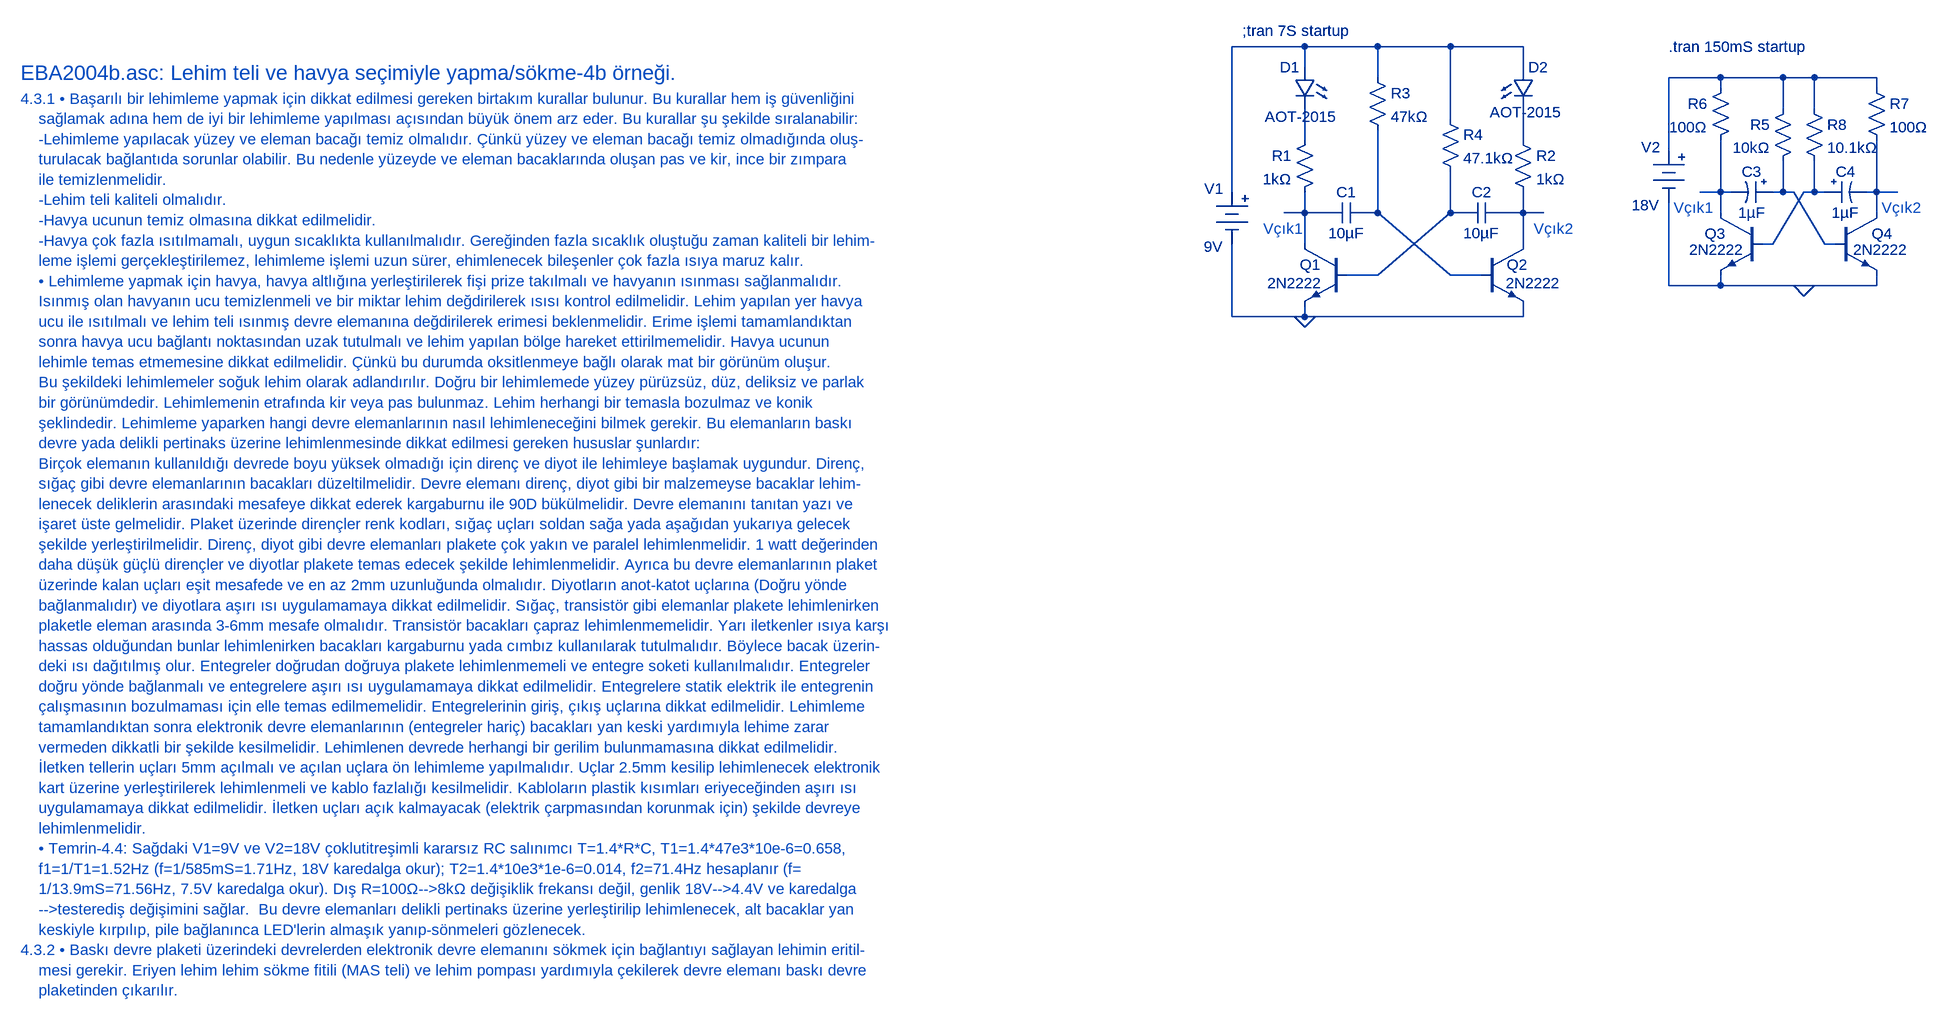
[diagram p0: schematic EBA2004b.asc]
EBA2004b.asc, the LTspice schematic file:
Version 4
SHEET 1 7064 4332
WIRE 1744 16 1632 16
WIRE 1856 16 1744 16
WIRE 1968 16 1856 16
WIRE 2080 16 1968 16
WIRE 1744 48 1744 16
WIRE 2080 48 2080 16
WIRE 1856 64 1856 16
WIRE 2384 64 2304 64
WIRE 2480 64 2384 64
WIRE 2528 64 2480 64
WIRE 2624 64 2528 64
WIRE 2384 80 2384 64
WIRE 2624 80 2624 64
WIRE 2480 112 2480 64
WIRE 2528 112 2528 64
WIRE 1968 128 1968 16
WIRE 1744 160 1744 112
WIRE 2080 160 2080 112
WIRE 2304 176 2304 64
WIRE 1632 240 1632 16
WIRE 2384 240 2384 160
WIRE 2384 240 2352 240
WIRE 2400 240 2384 240
WIRE 2480 240 2480 192
WIRE 2480 240 2464 240
WIRE 2496 240 2480 240
WIRE 2528 240 2528 192
WIRE 2528 240 2512 240
WIRE 2544 240 2528 240
WIRE 2624 240 2624 160
WIRE 2624 240 2608 240
WIRE 2656 240 2624 240
WIRE 1744 272 1744 240
WIRE 1744 272 1712 272
WIRE 1776 272 1744 272
WIRE 1856 272 1856 144
WIRE 1856 272 1840 272
WIRE 1968 272 1968 208
WIRE 1984 272 1968 272
WIRE 2080 272 2080 240
WIRE 2080 272 2048 272
WIRE 2112 272 2080 272
WIRE 2384 272 2384 240
WIRE 2624 272 2624 240
WIRE 1744 320 1744 272
WIRE 2080 320 2080 272
WIRE 2464 320 2512 240
WIRE 2464 320 2448 320
WIRE 2544 320 2496 240
WIRE 2560 320 2544 320
WIRE 1856 368 1968 272
WIRE 1856 368 1808 368
WIRE 1968 368 1856 272
WIRE 2016 368 1968 368
WIRE 2304 384 2304 256
WIRE 2384 384 2384 368
WIRE 2384 384 2304 384
WIRE 2512 384 2384 384
WIRE 2624 384 2624 368
WIRE 2624 384 2512 384
WIRE 1632 432 1632 320
WIRE 1744 432 1744 416
WIRE 1744 432 1632 432
WIRE 2080 432 2080 416
WIRE 2080 432 1744 432
FLAG 1744 432 0
FLAG 2512 384 0
SYMBOL Misc\\battery 1632 224 M0
WINDOW 0 13 11 Left 2
WINDOW 3 14 100 Left 2
SYMATTR InstName V1
SYMATTR Value 9V
SYMBOL npn 1808 320 M0
WINDOW 0 39 32 Left 2
WINDOW 3 37 60 Left 2
SYMATTR InstName Q1
SYMATTR Value 2N2222
SYMBOL npn 2016 320 R0
WINDOW 0 39 32 Left 2
WINDOW 3 37 60 Left 2
SYMATTR InstName Q2
SYMATTR Value 2N2222
SYMBOL res 1760 144 M0
SYMATTR InstName R1
SYMATTR Value 1kΩ
SYMBOL res 2064 144 R0
SYMATTR InstName R2
SYMATTR Value 1kΩ
SYMBOL LED 1760 48 M0
WINDOW 3 -34 76 Left 2
SYMATTR Value AOT-2015
SYMATTR InstName D1
SYMATTR Description Diode
SYMATTR Type diode
SYMBOL LED 2064 48 R0
WINDOW 3 -35 69 Left 2
SYMATTR Value AOT-2015
SYMATTR InstName D2
SYMATTR Description Diode
SYMATTR Type diode
SYMBOL res 1840 48 R0
SYMATTR InstName R3
SYMATTR Value 47kΩ
SYMBOL res 1952 112 R0
SYMATTR InstName R4
SYMATTR Value 47.1kΩ
SYMBOL cap 1840 256 R90
WINDOW 0 0 32 VBottom 2
WINDOW 3 32 32 VTop 2
SYMATTR InstName C1
SYMATTR Value 10µF
SYMBOL cap 2048 256 R90
WINDOW 0 0 32 VBottom 2
WINDOW 3 32 32 VTop 2
SYMATTR InstName C2
SYMATTR Value 10µF
SYMBOL npn 2448 272 M0
WINDOW 3 28 57 Left 2
SYMATTR Value 2N2222
SYMATTR InstName Q3
SYMBOL res 2496 96 M0
SYMATTR InstName R5
SYMATTR Value 10kΩ
SYMBOL polcap 2464 224 R90
WINDOW 0 0 32 VBottom 2
WINDOW 3 32 32 VTop 2
SYMATTR InstName C3
SYMATTR Value 1µF
SYMBOL res 2400 64 M0
SYMATTR InstName R6
SYMATTR Value 100Ω
SYMBOL npn 2560 272 R0
WINDOW 3 28 57 Left 2
SYMATTR Value 2N2222
SYMATTR InstName Q4
SYMBOL res 2608 64 R0
SYMATTR InstName R7
SYMATTR Value 100Ω
SYMBOL polcap 2544 224 M90
WINDOW 0 0 32 VBottom 2
WINDOW 3 32 32 VTop 2
SYMATTR InstName C4
SYMATTR Value 1µF
SYMBOL res 2512 96 R0
SYMATTR InstName R8
SYMATTR Value 10.1kΩ
SYMBOL Misc\\battery 2304 160 M0
WINDOW 0 13 11 Left 2
WINDOW 3 14 100 Left 2
SYMATTR InstName V2
SYMATTR Value 18V
TEXT -232 56 Left 3 ;EBA2004b.asc: Lehim teli ve havya seçimiyle yapma/sökme-4b örneği.
TEXT -232 96 Left 2 ;4.3.1 • Başarılı bir lehimleme yapmak için dikkat edilmesi gereken birtakım kurallar bulunur. Bu kurallar hem iş güvenliğini \n    sağlamak adına hem de iyi bir lehimleme yapılması açısından büyük önem arz eder. Bu kurallar şu şekilde sıralanabilir:\n    -Lehimleme yapılacak yüzey ve eleman bacağı temiz olmalıdır. Çünkü yüzey ve eleman bacağı temiz olmadığında oluş-\n    turulacak bağlantıda sorunlar olabilir. Bu nedenle yüzeyde ve eleman bacaklarında oluşan pas ve kir, ince bir zımpara \n    ile temizlenmelidir.\n    -Lehim teli kaliteli olmalıdır.\n    -Havya ucunun temiz olmasına dikkat edilmelidir.\n    -Havya çok fazla ısıtılmamalı, uygun sıcaklıkta kullanılmalıdır. Gereğinden fazla sıcaklık oluştuğu zaman kaliteli bir lehim-\n    leme işlemi gerçekleştirilemez, lehimleme işlemi uzun sürer, ehimlenecek bileşenler çok fazla ısıya maruz kalır.\n    • Lehimleme yapmak için havya, havya altlığına yerleştirilerek fişi prize takılmalı ve havyanın ısınması sağlanmalıdır.\n    Isınmış olan havyanın ucu temizlenmeli ve bir miktar lehim değdirilerek ısısı kontrol edilmelidir. Lehim yapılan yer havya \n    ucu ile ısıtılmalı ve lehim teli ısınmış devre elemanına değdirilerek erimesi beklenmelidir. Erime işlemi tamamlandıktan \n    sonra havya ucu bağlantı noktasından uzak tutulmalı ve lehim yapılan bölge hareket ettirilmemelidir. Havya ucunun \n    lehimle temas etmemesine dikkat edilmelidir. Çünkü bu durumda oksitlenmeye bağlı olarak mat bir görünüm oluşur. \n    Bu şekildeki lehimlemeler soğuk lehim olarak adlandırılır. Doğru bir lehimlemede yüzey pürüzsüz, düz, deliksiz ve parlak \n    bir görünümdedir. Lehimlemenin etrafında kir veya pas bulunmaz. Lehim herhangi bir temasla bozulmaz ve konik\n    şeklindedir. Lehimleme yaparken hangi devre elemanlarının nasıl lehimleneceğini bilmek gerekir. Bu elemanların baskı \n    devre yada delikli pertinaks üzerine lehimlenmesinde dikkat edilmesi gereken hususlar şunlardır:\n    Birçok elemanın kullanıldığı devrede boyu yüksek olmadığı için direnç ve diyot ile lehimleye başlamak uygundur. Direnç, \n    sığaç gibi devre elemanlarının bacakları düzeltilmelidir. Devre elemanı direnç, diyot gibi bir malzemeyse bacaklar lehim-\n    lenecek deliklerin arasındaki mesafeye dikkat ederek kargaburnu ile 90D bükülmelidir. Devre elemanını tanıtan yazı ve \n    işaret üste gelmelidir. Plaket üzerinde dirençler renk kodları, sığaç uçları soldan sağa yada aşağıdan yukarıya gelecek \n    şekilde yerleştirilmelidir. Direnç, diyot gibi devre elemanları plakete çok yakın ve paralel lehimlenmelidir. 1 watt değerinden\n    daha düşük güçlü dirençler ve diyotlar plakete temas edecek şekilde lehimlenmelidir. Ayrıca bu devre elemanlarının plaket \n    üzerinde kalan uçları eşit mesafede ve en az 2mm uzunluğunda olmalıdır. Diyotların anot-katot uçlarına (Doğru yönde \n    bağlanmalıdır) ve diyotlara aşırı ısı uygulamamaya dikkat edilmelidir. Sığaç, transistör gibi elemanlar plakete lehimlenirken \n    plaketle eleman arasında 3-6mm mesafe olmalıdır. Transistör bacakları çapraz lehimlenmemelidir. Yarı iletkenler ısıya karşı \n    hassas olduğundan bunlar lehimlenirken bacakları kargaburnu yada cımbız kullanılarak tutulmalıdır. Böylece bacak üzerin-\n    deki ısı dağıtılmış olur. Entegreler doğrudan doğruya plakete lehimlenmemeli ve entegre soketi kullanılmalıdır. Entegreler\n    doğru yönde bağlanmalı ve entegrelere aşırı ısı uygulamamaya dikkat edilmelidir. Entegrelere statik elektrik ile entegrenin \n    çalışmasının bozulmaması için elle temas edilmemelidir. Entegrelerinin giriş, çıkış uçlarına dikkat edilmelidir. Lehimleme \n    tamamlandıktan sonra elektronik devre elemanlarının (entegreler hariç) bacakları yan keski yardımıyla lehime zarar \n    vermeden dikkatli bir şekilde kesilmelidir. Lehimlenen devrede herhangi bir gerilim bulunmamasına dikkat edilmelidir.\n    İletken tellerin uçları 5mm açılmalı ve açılan uçlara ön lehimleme yapılmalıdır. Uçlar 2.5mm kesilip lehimlenecek elektronik \n    kart üzerine yerleştirilerek lehimlenmeli ve kablo fazlalığı kesilmelidir. Kabloların plastik kısımları eriyeceğinden aşırı ısı \n    uygulamamaya dikkat edilmelidir. İletken uçları açık kalmayacak (elektrik çarpmasından korunmak için) şekilde devreye\n    lehimlenmelidir.\n    • Temrin-4.4: Sağdaki V1=9V ve V2=18V çoklutitreşimli kararsız RC salınımcı T=1.4*R*C, T1=1.4*47e3*10e-6=0.658,\n    f1=1/T1=1.52Hz (f=1/585mS=1.71Hz, 18V karedalga okur); T2=1.4*10e3*1e-6=0.014, f2=71.4Hz hesaplanır (f=\n    1/13.9mS=71.56Hz, 7.5V karedalga okur). Dış R=100Ω-->8kΩ değişiklik frekansı değil, genlik 18V-->4.4V ve karedalga\n    -->testerediş değişimini sağlar.  Bu devre elemanları delikli pertinaks üzerine yerleştirilip lehimlenecek, alt bacaklar yan\n    keskiyle kırpılıp, pile bağlanınca LED'lerin almaşık yanıp-sönmeleri gözlenecek.\n4.3.2 • Baskı devre plaketi üzerindeki devrelerden elektronik devre elemanını sökmek için bağlantıyı sağlayan lehimin eritil-\n    mesi gerekir. Eriyen lehim lehim sökme fitili (MAS teli) ve lehim pompası yardımıyla çekilerek devre elemanı baskı devre \n    plaketinden çıkarılır.
TEXT 1648 -8 Left 2 !;tran 7S startup
TEXT 2312 264 Left 2 ;Vçık1
TEXT 2632 264 Left 2 ;Vçık2
TEXT 2096 296 Left 2 ;Vçık2
TEXT 1680 296 Left 2 ;Vçık1
TEXT 2304 16 Left 2 !.tran 150mS startup

The netlist it stands for:
* EBA2004b.asc
V1 N001 0 9V
Q1 N009 N011 0 0 2N2222
Q2 N012 N010 0 0 2N2222
R1 N003 N009 1kΩ
R2 N004 N012 1kΩ
D1 N001 N003 AOT-2015
D2 N001 N004 AOT-2015
R3 N001 N010 47kΩ
R4 N001 N011 47.1kΩ
C1 N010 N009 10µF
C2 N012 N011 10µF
Q3 N005 N007 0 0 2N2222
R5 N002 N006 10kΩ
C3 N006 N005 1µF
R6 N002 N005 100Ω
Q4 N008 N006 0 0 2N2222
R7 N002 N008 100Ω
C4 N007 N008 1µF
R8 N002 N007 10.1kΩ
V2 N002 0 18V
.model D D
.lib standard.dio
.model NPN NPN
.model PNP PNP
.lib standard.bjt
* EBA2004b.asc: Lehim teli ve havya seçimiyle yapma/sökme-4b örneği.
* 4.3.1 • Başarılı bir lehimleme yapmak için dikkat edilmesi gereken birtakım kurallar bulunur. Bu kurallar hem iş güvenliğini
*     sağlamak adına hem de iyi bir lehimleme yapılması açısından büyük önem arz eder. Bu kurallar şu şekilde sıralanabilir:
*     -Lehimleme yapılacak yüzey ve eleman bacağı temiz olmalıdır. Çünkü yüzey ve eleman bacağı temiz olmadığında oluş-
*     turulacak bağlantıda sorunlar olabilir. Bu nedenle yüzeyde ve eleman bacaklarında oluşan pas ve kir, ince bir zımpara
*     ile temizlenmelidir.
*     -Lehim teli kaliteli olmalıdır.
*     -Havya ucunun temiz olmasına dikkat edilmelidir.
*     -Havya çok fazla ısıtılmamalı, uygun sıcaklıkta kullanılmalıdır. Gereğinden fazla sıcaklık oluştuğu zaman kaliteli bir lehim-
*     leme işlemi gerçekleştirilemez, lehimleme işlemi uzun sürer, ehimlenecek bileşenler çok fazla ısıya maruz kalır.
*     • Lehimleme yapmak için havya, havya altlığına yerleştirilerek fişi prize takılmalı ve havyanın ısınması sağlanmalıdır.
*     Isınmış olan havyanın ucu temizlenmeli ve bir miktar lehim değdirilerek ısısı kontrol edilmelidir. Lehim yapılan yer havya
*     ucu ile ısıtılmalı ve lehim teli ısınmış devre elemanına değdirilerek erimesi beklenmelidir. Erime işlemi tamamlandıktan
*     sonra havya ucu bağlantı noktasından uzak tutulmalı ve lehim yapılan bölge hareket ettirilmemelidir. Havya ucunun
*     lehimle temas etmemesine dikkat edilmelidir. Çünkü bu durumda oksitlenmeye bağlı olarak mat bir görünüm oluşur.
*     Bu şekildeki lehimlemeler soğuk lehim olarak adlandırılır. Doğru bir lehimlemede yüzey pürüzsüz, düz, deliksiz ve parlak
*     bir görünümdedir. Lehimlemenin etrafında kir veya pas bulunmaz. Lehim herhangi bir temasla bozulmaz ve konik
*     şeklindedir. Lehimleme yaparken hangi devre elemanlarının nasıl lehimleneceğini bilmek gerekir. Bu elemanların baskı
*     devre yada delikli pertinaks üzerine lehimlenmesinde dikkat edilmesi gereken hususlar şunlardır:
*     Birçok elemanın kullanıldığı devrede boyu yüksek olmadığı için direnç ve diyot ile lehimleye başlamak uygundur. Direnç,
*     sığaç gibi devre elemanlarının bacakları düzeltilmelidir. Devre elemanı direnç, diyot gibi bir malzemeyse bacaklar lehim-
*     lenecek deliklerin arasındaki mesafeye dikkat ederek kargaburnu ile 90D bükülmelidir. Devre elemanını tanıtan yazı ve
*     işaret üste gelmelidir. Plaket üzerinde dirençler renk kodları, sığaç uçları soldan sağa yada aşağıdan yukarıya gelecek
*     şekilde yerleştirilmelidir. Direnç, diyot gibi devre elemanları plakete çok yakın ve paralel lehimlenmelidir. 1 watt değerinden
*     daha düşük güçlü dirençler ve diyotlar plakete temas edecek şekilde lehimlenmelidir. Ayrıca bu devre elemanlarının plaket
*     üzerinde kalan uçları eşit mesafede ve en az 2mm uzunluğunda olmalıdır. Diyotların anot-katot uçlarına (Doğru yönde
*     bağlanmalıdır) ve diyotlara aşırı ısı uygulamamaya dikkat edilmelidir. Sığaç, transistör gibi elemanlar plakete lehimlenirken
*     plaketle eleman arasında 3-6mm mesafe olmalıdır. Transistör bacakları çapraz lehimlenmemelidir. Yarı iletkenler ısıya karşı
*     hassas olduğundan bunlar lehimlenirken bacakları kargaburnu yada cımbız kullanılarak tutulmalıdır. Böylece bacak üzerin-
*     deki ısı dağıtılmış olur. Entegreler doğrudan doğruya plakete lehimlenmemeli ve entegre soketi kullanılmalıdır. Entegreler
*     doğru yönde bağlanmalı ve entegrelere aşırı ısı uygulamamaya dikkat edilmelidir. Entegrelere statik elektrik ile entegrenin
*     çalışmasının bozulmaması için elle temas edilmemelidir. Entegrelerinin giriş, çıkış uçlarına dikkat edilmelidir. Lehimleme
*     tamamlandıktan sonra elektronik devre elemanlarının (entegreler hariç) bacakları yan keski yardımıyla lehime zarar
*     vermeden dikkatli bir şekilde kesilmelidir. Lehimlenen devrede herhangi bir gerilim bulunmamasına dikkat edilmelidir.
*     İletken tellerin uçları 5mm açılmalı ve açılan uçlara ön lehimleme yapılmalıdır. Uçlar 2.5mm kesilip lehimlenecek elektronik
*     kart üzerine yerleştirilerek lehimlenmeli ve kablo fazlalığı kesilmelidir. Kabloların plastik kısımları eriyeceğinden aşırı ısı
*     uygulamamaya dikkat edilmelidir. İletken uçları açık kalmayacak (elektrik çarpmasından korunmak için) şekilde devreye
*     lehimlenmelidir.
*     • Temrin-4.4: Sağdaki V1=9V ve V2=18V çoklutitreşimli kararsız RC salınımcı T=1.4*R*C, T1=1.4*47e3*10e-6=0.658,
*     f1=1/T1=1.52Hz (f=1/585mS=1.71Hz, 18V karedalga okur); T2=1.4*10e3*1e-6=0.014, f2=71.4Hz hesaplanır (f=
*     1/13.9mS=71.56Hz, 7.5V karedalga okur). Dış R=100Ω-->8kΩ değişiklik frekansı değil, genlik 18V-->4.4V ve karedalga
*     -->testerediş değişimini sağlar.  Bu devre elemanları delikli pertinaks üzerine yerleştirilip lehimlenecek, alt bacaklar yan
*     keskiyle kırpılıp, pile bağlanınca LED'lerin almaşık yanıp-sönmeleri gözlenecek.
* 4.3.2 • Baskı devre plaketi üzerindeki devrelerden elektronik devre elemanını sökmek için bağlantıyı sağlayan lehimin eritil-
*     mesi gerekir. Eriyen lehim lehim sökme fitili (MAS teli) ve lehim pompası yardımıyla çekilerek devre elemanı baskı devre
*     plaketinden çıkarılır.
;tran 7S startup
* Vçık1
* Vçık2
* Vçık2
* Vçık1
.tran 150mS startup
.backanno
.end